# EAGLE design WiFiChristmasStar (EAGLE 9.2.2)
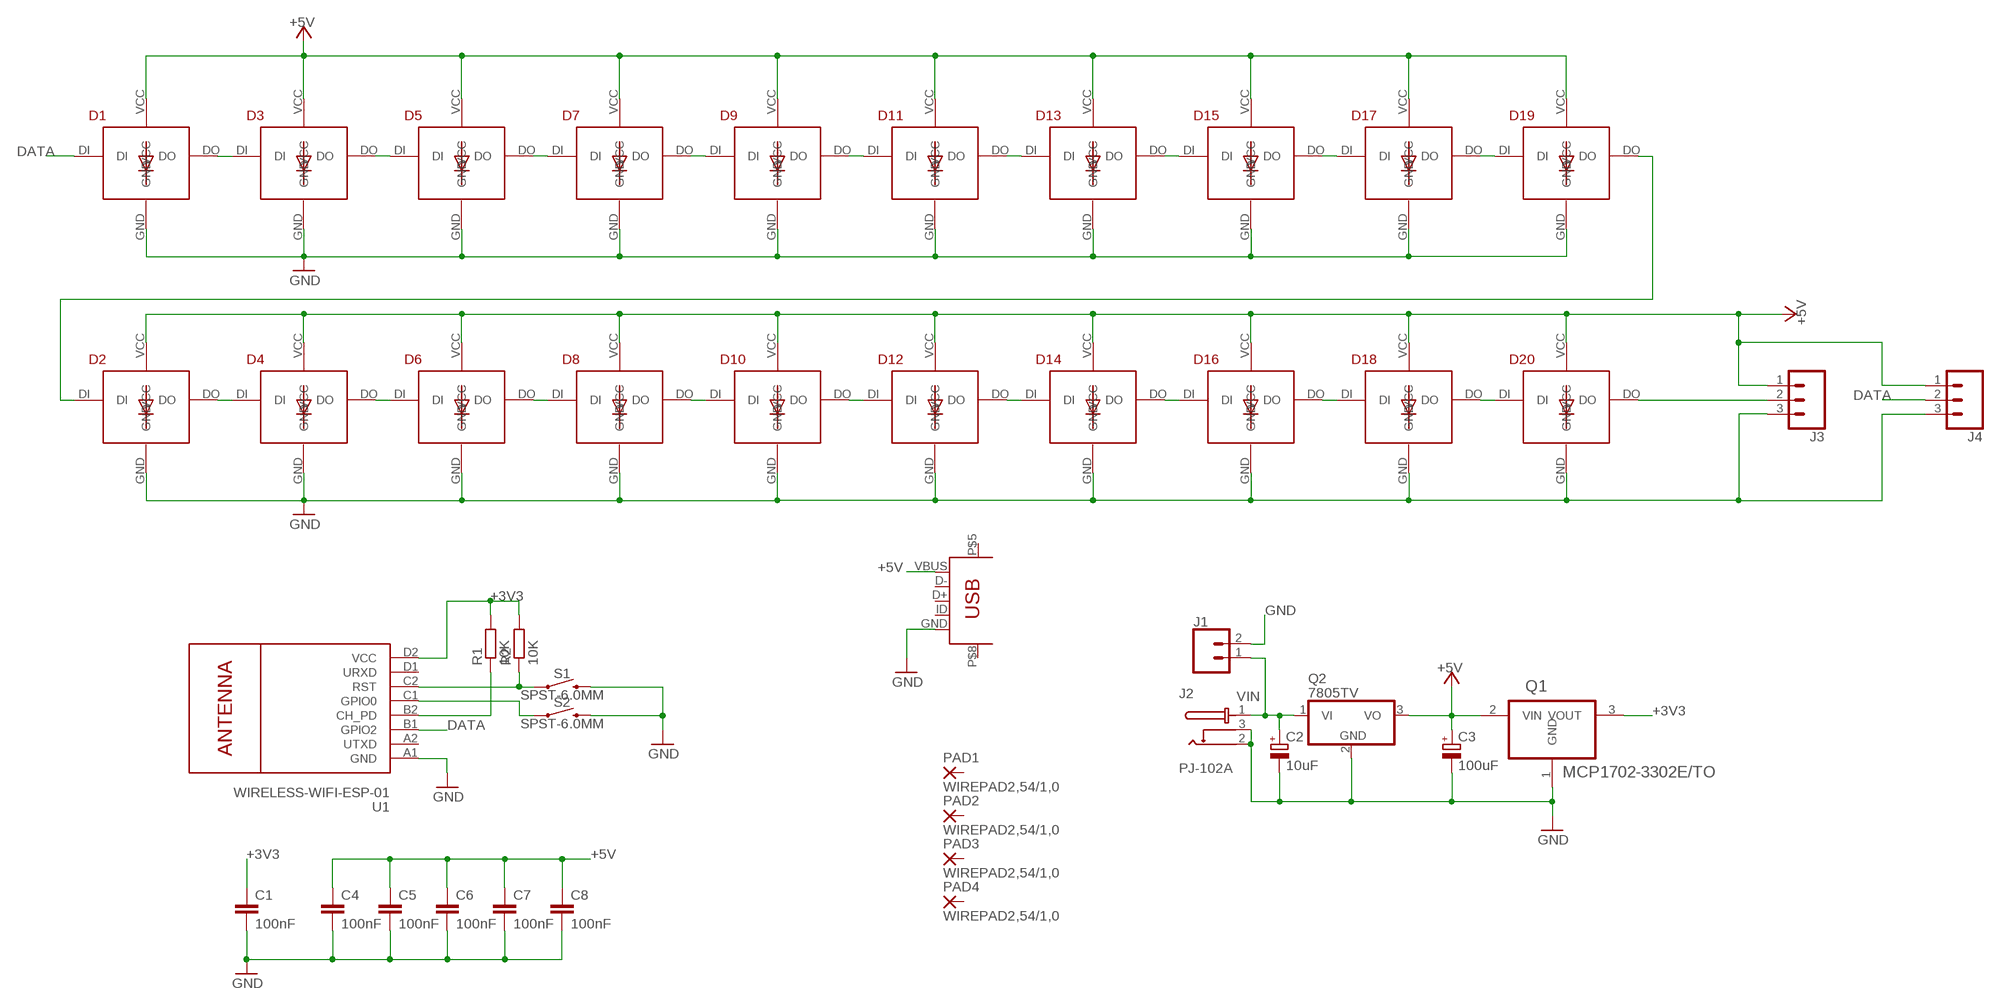
[diagram p0: schematic, sheet 1]

## Parts
C1  100nF  C-EU025-025X050  [C025-025X050]
C2  10uF  CPOL-EUE2.5-6  [E2,5-6]
C3  100uF  CPOL-EUE2.5-6  [E2,5-6]
C4  100nF  C-EU025-025X050  [C025-025X050]
C5  100nF  C-EU025-025X050  [C025-025X050]
C6  100nF  C-EU025-025X050  [C025-025X050]
C7  100nF  C-EU025-025X050  [C025-025X050]
C8  100nF  C-EU025-025X050  [C025-025X050]
CON1  MOLEX-548190519-MICROUSB  [MOLEX-548190519]
D1  APA-106  [LED5MMRGB]
D2  APA-106  [LED5MMRGB]
D3  APA-106  [LED5MMRGB]
D4  APA-106  [LED5MMRGB]
D5  APA-106  [LED5MMRGB]
D6  APA-106  [LED5MMRGB]
D7  APA-106  [LED5MMRGB]
D8  APA-106  [LED5MMRGB]
D9  APA-106  [LED5MMRGB]
D10  APA-106  [LED5MMRGB]
D11  APA-106  [LED5MMRGB]
D12  APA-106  [LED5MMRGB]
D13  APA-106  [LED5MMRGB]
D14  APA-106  [LED5MMRGB]
D15  APA-106  [LED5MMRGB]
D16  APA-106  [LED5MMRGB]
D17  APA-106  [LED5MMRGB]
D18  APA-106  [LED5MMRGB]
D19  APA-106  [LED5MMRGB]
D20  APA-106  [LED5MMRGB]
J1  CONN_023.5MM  [SCREWTERMINAL-3.5MM-2]
J2  PJ-102A  [CUI_PJ-102A]
J3  CONN_03SCREW  [SCREWTERMINAL-3.5MM-3]
J4  CONN_03SCREW  [SCREWTERMINAL-3.5MM-3]
PAD1  WIREPAD2,54/1,0  [2,54/1,0]
PAD2  WIREPAD2,54/1,0  [2,54/1,0]
PAD3  WIREPAD2,54/1,0  [2,54/1,0]
PAD4  WIREPAD2,54/1,0  [2,54/1,0]
Q1  MCP1702-3302E/TO  [TO127P254X533-3]
Q2  7805TV  [TO220V]
R1  10K  R-EU_0204/7  [0204/7]
R2  10K  R-EU_0204/7  [0204/7]
S1  SPST-6.0MM  MOMENTARY-SWITCH-SPST-PTH-6.0MM  [TACTILE_SWITCH_PTH_6.0MM]
S2  SPST-6.0MM  MOMENTARY-SWITCH-SPST-PTH-6.0MM  [TACTILE_SWITCH_PTH_6.0MM]
U1  WIRELESS-WIFI-ESP-01  [WIRELESS-WIFI-ESP-01]

## Nets
+3V3: C1.1 Q1.3(VOUT) R1.2 R2.2 U1.D2(VCC)
+5V [power]: C3.+ C4.1 C5.1 C6.1 C7.1 C8.1 CON1.VBUS D1.VCC D2.VCC D3.VCC D4.VCC D5.VCC D6.VCC D7.VCC D8.VCC D9.VCC D10.VCC D11.VCC D12.VCC D13.VCC D14.VCC D15.VCC D16.VCC D17.VCC D18.VCC D19.VCC D20.VCC J3.1 J4.1 Q1.2(VIN) Q2.3(VO)
DATA: D1.DI J4.2 U1.B1(GPIO2)
GND [power]: C1.2 C2.- C3.- C4.2 C5.2 C6.2 C7.2 C8.2 CON1.GND D1.GND D2.GND D3.GND D4.GND D5.GND D6.GND D7.GND D8.GND D9.GND D10.GND D11.GND D12.GND D13.GND D14.GND D15.GND D16.GND D17.GND D18.GND D19.GND D20.GND J1.2 J2.2 J2.3 J3.3 J4.3 Q1.1(GND) Q2.2(GND) S1.3 S2.3 U1.A1(GND)
N$1: S2.1 U1.C1(GPIO0)
N$2: D2.DO D4.DI
N$4: D4.DO D6.DI
N$5: R1.1 U1.B2(CH_PD)
N$6: R2.1 S1.1 U1.C2(RST)
N$7: D6.DO D8.DI
N$8: D8.DO D10.DI
N$9: D2.DI D19.DO
N$10: D10.DO D12.DI
N$11: D12.DO D14.DI
N$12: D14.DO D16.DI
N$13: D16.DO D18.DI
N$14: D18.DO D20.DI
N$15: D20.DO J3.2
N$16: D1.DO D3.DI
N$17: D17.DO D19.DI
N$18: D15.DO D17.DI
N$19: D13.DO D15.DI
N$20: D11.DO D13.DI
N$21: D9.DO D11.DI
N$22: D7.DO D9.DI
N$23: D5.DO D7.DI
N$24: D3.DO D5.DI
VIN [power]: C2.+ J1.1 J2.1 Q2.1(VI)
Unconnected: CON1.D+ CON1.D- CON1.ID CON1.P$5(MTN2) CON1.P$8(MTN4) PAD1.1(P) PAD2.1(P) PAD3.1(P) PAD4.1(P) U1.A2(UTXD) U1.D1(URXD)

## Library data of the parts
C1 C4-C8 = rcl:C-EU: CAPACITOR, European symbol; SPICEPREFIX: C
C2 C3 = rcl:CPOL-EU: POLARIZED CAPACITOR, European symbol; SPICEPREFIX: C
CON1 = Ava:MOLEX-548190519-MICROUSB
D1-D20 = led_rgb:APA-106
J1 = SparkFun-Connectors:CONN_02: Multi connection point. Often used as Generic Header-pin footprint for 0.1 inch spaced/style header connections On any of the 0.1 inch spaced packages, you can populate with these: Break Away Headers - Straight <https://www.sparkfun.com/products/116> (PRT-00116) Break Away Male Headers - Right Angle <https://www.sparkfun.com/products/553> (PRT-00553) Female Headers <https://www.sparkfun.com/products/115> (PRT-00115) Break Away Headers - Machine Pin <https://www.sparkfun.com/products/117> (PRT-00117) Break Away Female Headers - Swiss Machine Pin <https://www.sparkfun.com/products/743> (PRT-00743) For SCREWTERMINALS and SPRING TERMINALS visit here: Screw Terimnals on SparkFun.com <https://www.sparkfun.com/search/results?term=Screw+Terminals> (5mm/3.5mm/2.54mm spacing) This device is also useful as a general connection point to wire up your design to another part of your project. Our various solder wires solder well into these plated through hole pads. Hook-Up Wire - Assortment (Stranded, 22 AWG) <https://www.sparkfun.com/products/11375> (PRT-11375) Hook-Up Wire - Assortment (Solid Core, 22 AWG) <https://www.sparkfun.com/products/11367> (PRT-11367) View the entire wire category on our website here <https://www.sparkfun.com/categories/141> Special notes: Molex polarized connector foot print use with: PRT-08233 with associated crimp pins and housings. 2.54_SCREWTERM for use with PRT-10571. 3.5mm Screw Terminal footprints for PRT-08084 5mm Screw Terminal footprints for use with PRT-08432; PROD_ID: CONN-08399
J2 = PJ-102A:PJ-102A: 2.0 mm Center Pin, 2.5 A, Right Angle, Through Hole, Tapered Pins, Dc Power Jack Connector; AVAILABILITY: Good; DESCRIPTION: 2.0 mm Center Pin%2C 2.5 A%2C Right Angle%2C Through Hole%2C Tapered Pins%2C Dc Power Jack Connector; MANUFACTURER: CUI inc; MF: CUI; MP: PJ-102A; PACKAGE: None; PRICE: 0.44 USD
J3 J4 = SparkFun-Connectors:CONN_03: Multi connection point. Often used as Generic Header-pin footprint for 0.1 inch spaced/style header connections On any of the 0.1 inch spaced packages, you can populate with these: Break Away Headers - Straight <https://www.sparkfun.com/products/116> (PRT-00116) Break Away Male Headers - Right Angle <https://www.sparkfun.com/products/553> (PRT-00553) Female Headers <https://www.sparkfun.com/products/115> (PRT-00115) Break Away Headers - Machine Pin <https://www.sparkfun.com/products/117> (PRT-00117) Break Away Female Headers - Swiss Machine Pin <https://www.sparkfun.com/products/743> (PRT-00743) Stackable Header - 3 Pin (Female, 0.1") <https://www.sparkfun.com/products/13875> (PRT-13875) For SCREWTERMINALS and SPRING TERMINALS visit here: Screw Terimnals on SparkFun.com <https://www.sparkfun.com/search/results?term=Screw+Terminals> (5mm/3.5mm/2.54mm spacing) This device is also useful as a general connection point to wire up your design to another part of your project. Our various solder wires solder well into these plated through hole pads. Hook-Up Wire - Assortment (Stranded, 22 AWG) <https://www.sparkfun.com/products/11375> (PRT-11375) Hook-Up Wire - Assortment (Solid Core, 22 AWG) <https://www.sparkfun.com/products/11367> (PRT-11367) View the entire wire category on our website here <https://www.sparkfun.com/categories/141> Special notes: Molex polarized connector foot print use with SKU : PRT-08232 with associated crimp pins and housings.; PROD_ID: CONN-08288; SF_ID: PRT-08235
PAD1-PAD4 = wirepad:WIREPAD: Wire PAD connect wire on PCB
Q1 = MCP1702:MCP1702-3302E/TO: IC, V REG, LDO, 250MA; MPN: MCP1702-3302E/TO; OC_FARNELL: 1331485; OC_NEWARK: 34M7419; PACKAGE: TO-92; SUPPLIER: Microchip
Q2 = linear:78*: Positive VOLTAGE REGULATOR Source: http://cache.national.com/ds/LM/LM78L05.pdf http://www.fairchildsemi.com/ds/LM/LM7805.pdf
R1 R2 = rcl:R-EU_: RESISTOR, European symbol; SPICEPREFIX: R
S1 S2 = SparkFun-Switches:MOMENTARY-SWITCH-SPST: Momentary Switch (Pushbutton) - SPST Normally-open (NO) SPST momentary switches (buttons, pushbuttons). Variants PTH-12MM - 12mm square, through-hole Momentary Pushbutton Switch - 12mm Square <https://www.sparkfun.com/products/9190> (COM-09190) PTH-6.0MM, PTH-6.0MM-KIT - 6.0mm square, through-hole Mini Pushbutton Switch <https://www.sparkfun.com/products/97> (COM-00097) KIT package intended for soldering kit's - only one side of pads' copper is exposed. PTH-RIGHT-ANGLE-KIT - Right-angle, through-hole Right Angle Tactile Button <https://www.sparkfun.com/products/10791> - Used on SparkFun BigTime Watch Kit <https://www.sparkfun.com/products/11734> SMD-12MM - 12mm square, surface-mount Tactile Button - SMD (12mm) <https://www.sparkfun.com/products/12993> (COM-12993) Used on SparkFun PicoBoard <https://www.sparkfun.com/products/11888> SMD-4.5MM - 4.5mm Square Trackball Switch Used on SparkFun Blackberry Trackballer Breakout <https://www.sparkfun.com/products/13169> SMD-4.6MMX2.8MM - 4.60mm x 2.80mm, surface mount Used on SparkFun SAMD21 Mini Breakout <https://www.sparkfun.com/products/13664> SMD-5.2MM, SMD-5.2-REDUNDANT - 5.2mm square, surface-mount Mini Pushbutton Switch - SMD <https://www.sparkfun.com/products/8720> (COM-08720) Used on Arduino Pro Mini <https://www.sparkfun.com/products/11114> REDUNDANT package connects both switch circuits together SMD-6.0X3.5MM - 6.0 x 3.5mm, surface mount Momentary Reset Switch SMD <https://www.sparkfun.com/products/8229> (COM-08229) SMD-6.2MM-TALL - 6.2mm square, surface mount Tactile Button - SMD (6mm) <https://www.sparkfun.com/products/12992> Used on SparkFun Digital Sandbox <https://www.sparkfun.com/products/12651> SMD-RIGHT-ANGLE - Right-angle, surface mount Used on SparkFun Block for Intel® Edison - Arduino <https://www.sparkfun.com/products/13036>; PROD_ID: SWCH-08441; SF_SKU: COM-00097
U1 = diy-modules:WIRELESS-WIFI-ESP-01: Wireless Wi-Fi ESP-01 Module based on ESP8266 chip Click here to find device on ebay.com <http://www.ebay.com/sch/esp8266+esp+01+transceiver>

## Net classes
0 default: width 0.152 mm, drill 0.152 mm, clearance 0.152 mm
1 power: width 0.254 mm, drill 0.152 mm, clearance 0.152 mm

## Board
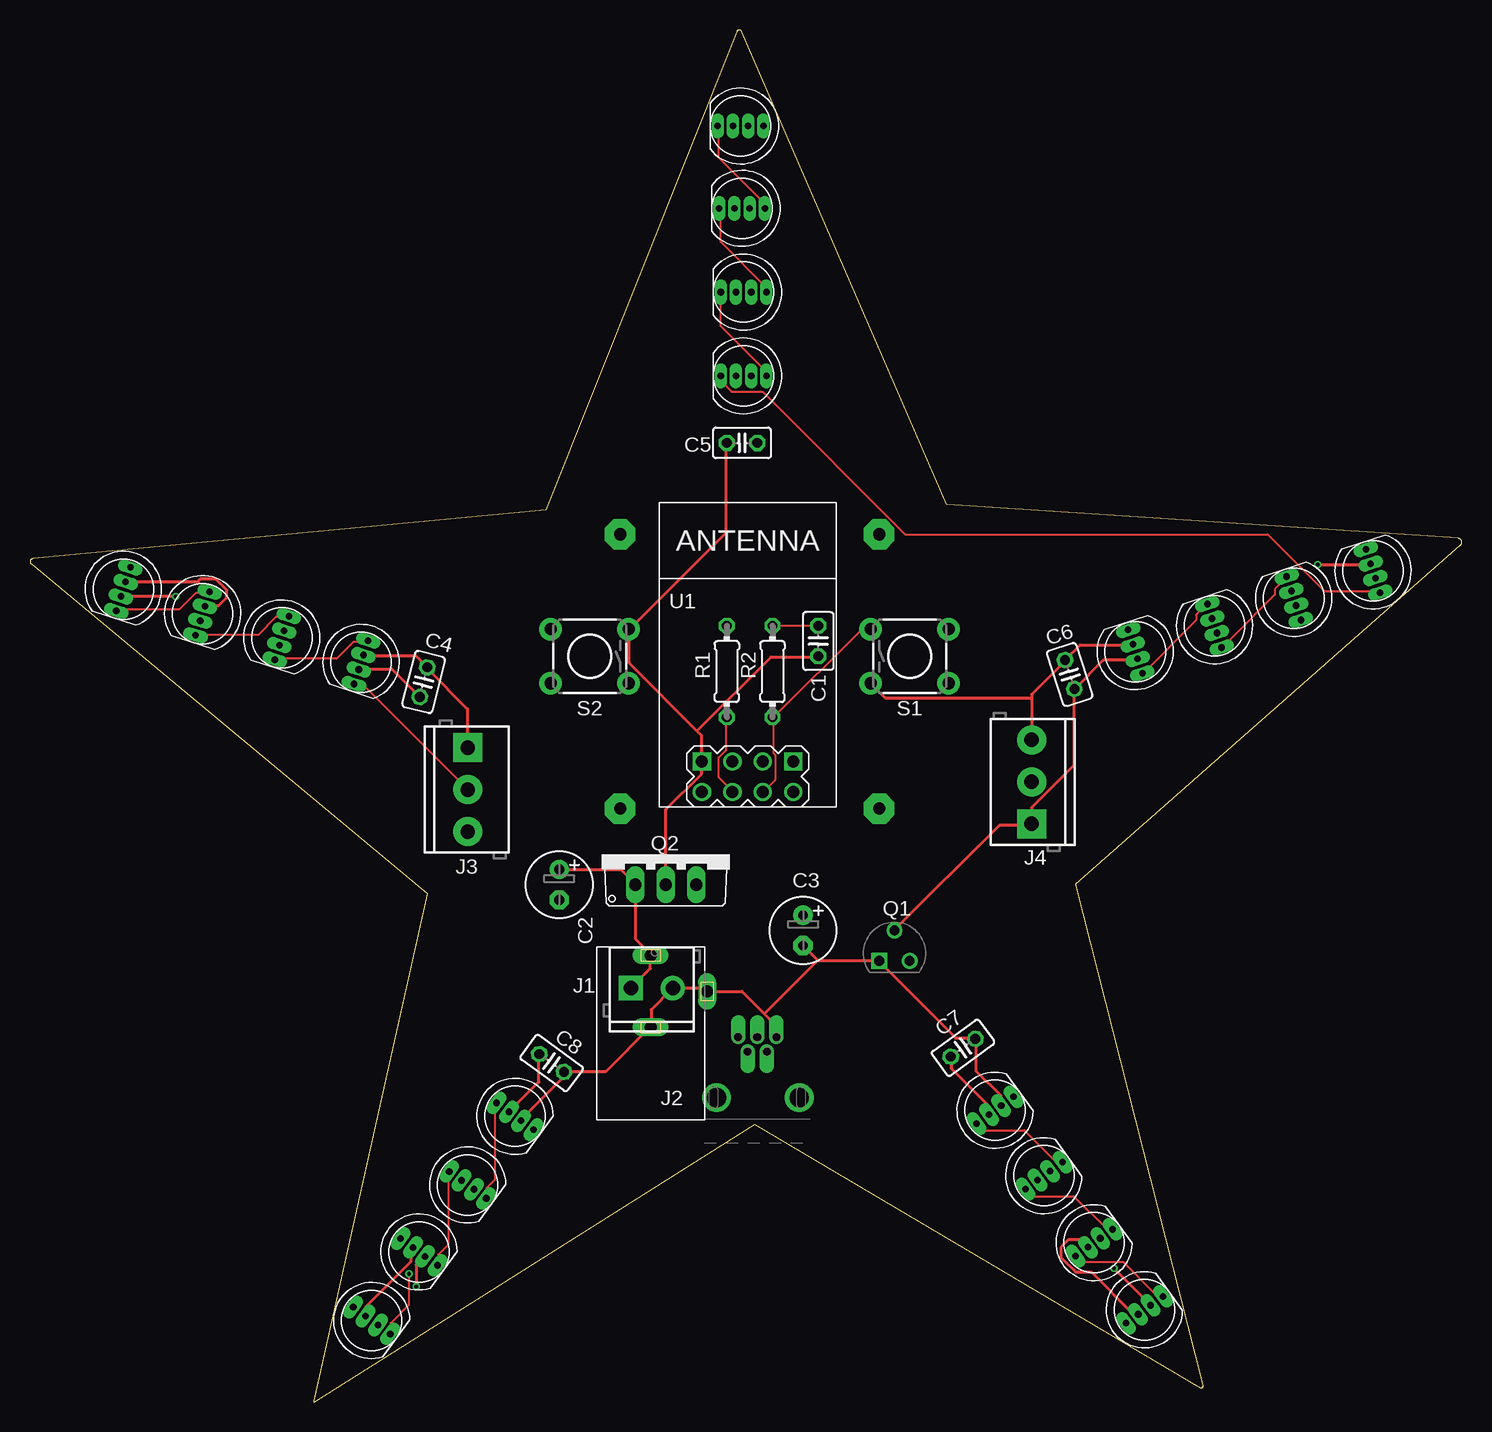
[diagram p1: board, top side]
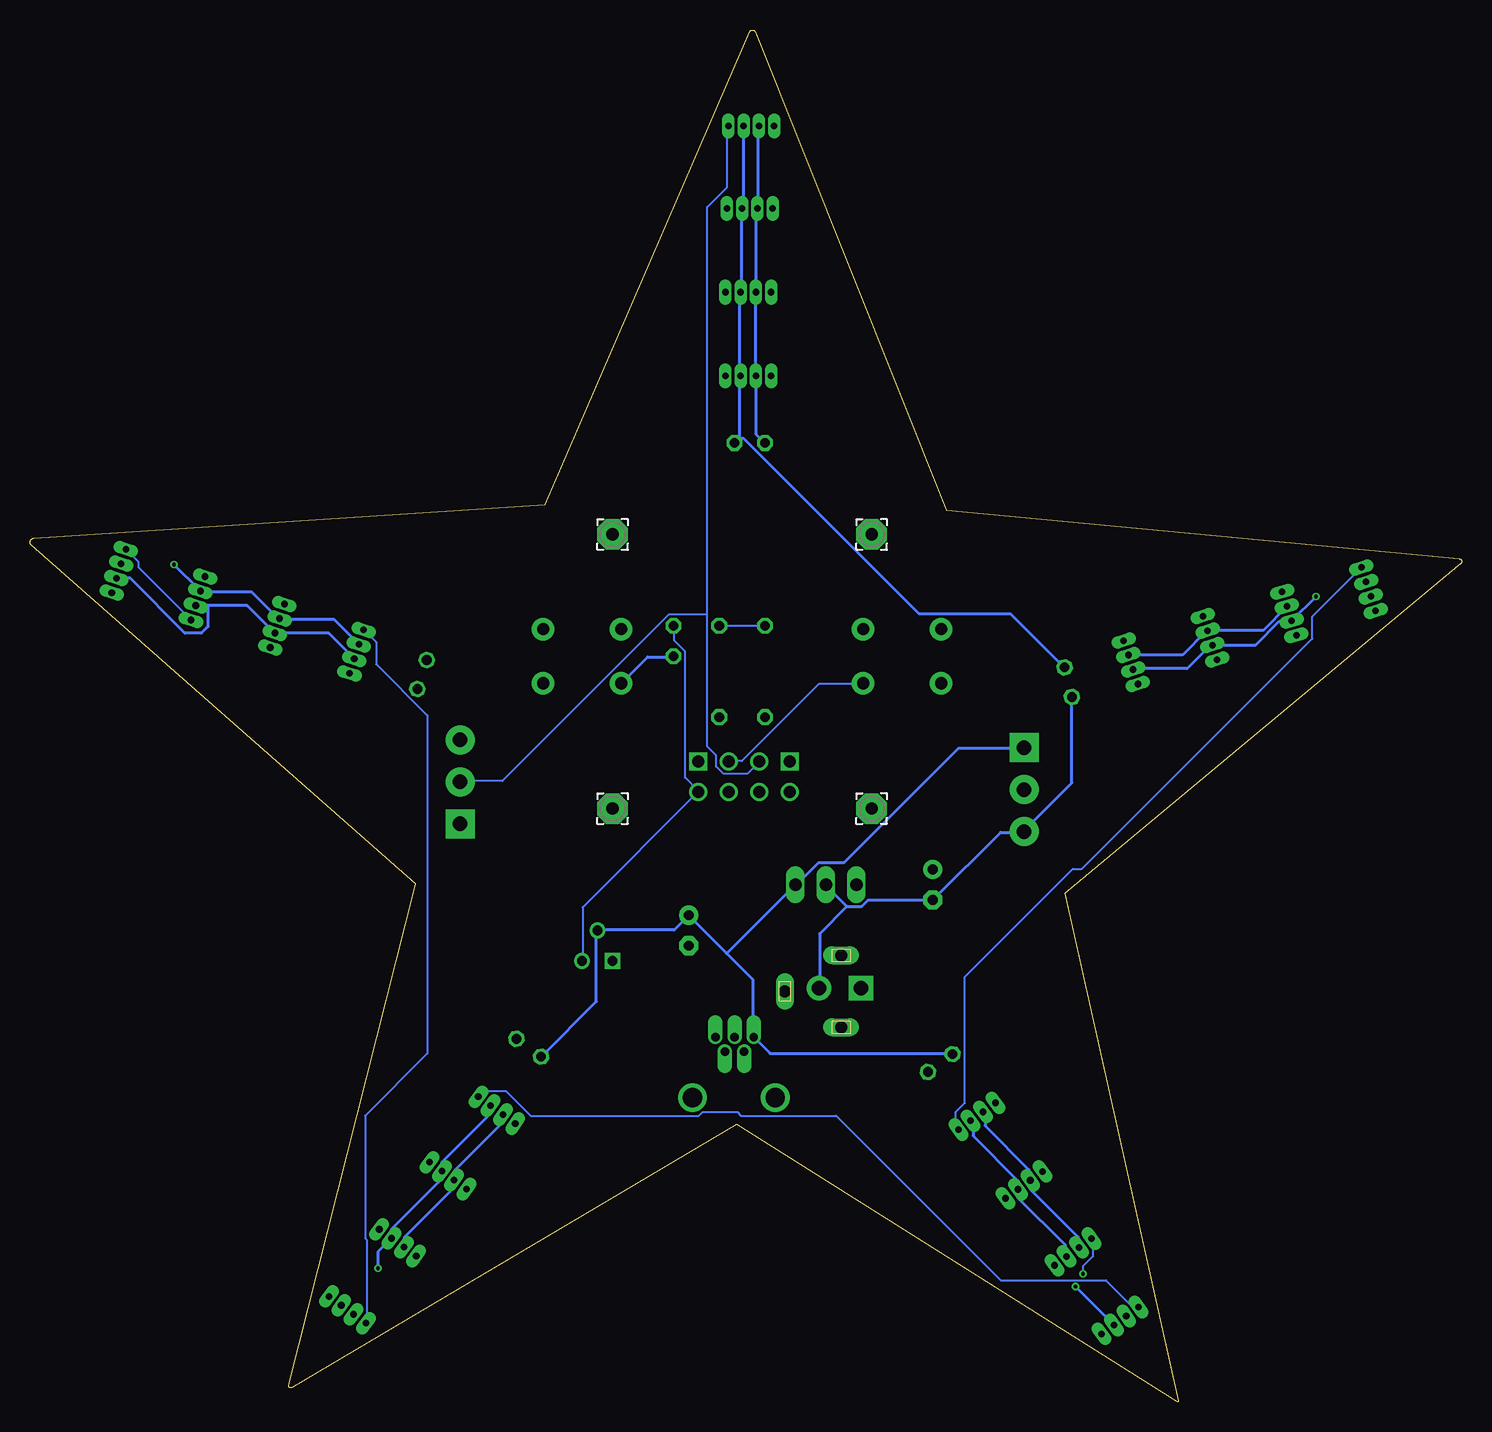
[diagram p2: board, bottom side, seen from below]

Size 119.32 x 114.36 mm. Coordinates in mm from the lower left corner, seen from the top.
Outline: 76.39,74.8 59.33,114.22 arc135 58.9,114.22 42.97,74.32 0.21,70.28 arc135 0.09,69.87 33.1,42.39 23.64,0.07 arc135 23.73,0.01 60.41,23.14 97.51,1.2 arc135 97.76,1.38 87.17,43.17 119.21,71.41 arc135 119.01,71.99 76.39,74.8
Copper layers (1*16): Top 0.035mm / dielectric 1.5mm / Bottom 0.035mm
Design rules "PCBWay": minimum track width 6mil, minimum drill 12mil, track to track 6mil, track to pad 6mil, pad to pad 6mil, via to via 6mil, smd to smd 0mil, copper to edge 10mil, drill to drill 10mil, minimum pad ring 10mil, minimum via ring 6mil, stop-mask expansion 2mil, vias tented up to drill 25mil, thermal gap 10mil
tRestrict: area -1.6,39.3 to 35.3,70.5; area 21.8,-1.3 to 62.1,24.1; area 86.3,-0.4 to 101.3,45.2; area 75.3,71.3 to 120.3,77.5; area 59.3,-1.8 to 98.4,22.8; area 18.9,-1.1 to 33.7,42.9; area 87.8,41.8 to 120.3,71; area 87.4,42.2 to 119.9,71.4
bRestrict: area -1.8,39 to 35.5,70.5; area 23.3,-0.4 to 62.1,24.1; area 86.4,0.4 to 101.6,45.1; area 75.6,71.3 to 120,76.7; area 60.5,-0.1 to 97.3,22.7; area 19.3,-1.2 to 33.8,43.5; area 87.3,42.2 to 119.8,71.4
Milling: 15 lines

### Footprints (pad centres in the part's own frame; a part is rotated, then mirrored left to right if it is on the bottom)
C025-025X050 = drill 0.813 octagon: 1 -1.27,0; 2 1.27,0
E2,5-6 = drill 0.813 pad 1.6: + -1.27,0 | drill 0.813 pad 1.6 octagon: - 1.27,0
MOLEX-548190519 = drill 0.7 pad 0.9 offset: D+ 0,0; D- -1.2,0.8; GND 0,-1.6; ID -1.2,-0.8; VBUS 0,1.6 | drill 1.6: P$5 -5.05,3.4; P$8 -5.05,-3.5
LED5MMRGB = drill 0.55 pad 1.016 long: DI 1.905,0; DO -1.905,0; GND -0.635,0; VCC 0.635,0
SCREWTERMINAL-3.5MM-2 = drill 1.2 pad 2.032 square: 1 0,0 | drill 1.2 pad 2.032: 2 3.5,0
CUI_PJ-102A = drill 1 long: 1 0,-3; 2 0,3; 3 -4.7,0
SCREWTERMINAL-3.5MM-3 = drill 1.2 pad 2.413 square: 1 0,0 | drill 1.2 pad 2.413: 2 3.5,0; 3 7,0
2,54/1,0 = drill 1.016 pad 2.54 octagon: 1 0,0
TO127P254X533-3 = drill 0.8 square: 1 -2.54,-2.54 | drill 0.8: 2 -1.27,0; 3 0,-2.54
TO220V = drill 1.016 long: 1 -2.54,-2.54; 2 0,-2.54; 3 2.54,-2.54
0204/7 = drill 0.813 octagon: 1 -3.81,0; 2 3.81,0
TACTILE_SWITCH_PTH_6.0MM = drill 1.016 pad 1.88: 1 -3.251,2.261; 2 3.251,2.261; 3 -3.251,-2.261; 4 3.251,-2.261
WIRELESS-WIFI-ESP-01 = drill 1 square: A1 -8.89,3.81; D1 -8.89,-3.81 | drill 1: A2 -11.43,3.81; B1 -8.89,1.27; B2 -11.43,1.27; C1 -8.89,-1.27; C2 -11.43,-1.27; D2 -11.43,-3.81

### Placement (x,y rotation side)
C1  65.69,63.43 270 top
C2  44.1,43.11 270 top
C3  64.42,39.3 270 top
C4  32.8,60 256 top
C5  59.34,79.94 180 top
C6  86.64,60.64 108 top
C7  77.75,29.52 36 top
C8  43.46,28.25 324 top
CON1  60.61,30.41 90 top
D1  59.21,106.36 0 top
D2  84.48,18.85 216 top
D3  59.34,99.5 0 top
D4  80.42,24.31 216 top
D5  59.47,92.51 0 top
D6  28.48,6.79 144 top
D7  59.47,85.53 0 top
D8  32.41,12.5 144 top
D9  111.92,69.27 288 top
D10  36.48,18.09 144 top
D11  105.31,66.99 288 top
D12  40.42,23.81 144 top
D13  98.71,64.7 288 top
D14  7.78,67.75 72 top
D15  92.1,62.54 288 top
D16  14.38,65.72 72 top
D17  92.87,7.68 216 top
D18  20.98,63.68 72 top
D19  88.68,13.26 216 top
D20  27.59,61.65 72 top
J1  50.07,34.47 0 top
J2  51.72,34.22 180 top
J3  36.48,54.54 270 top
J4  83.47,48.19 90 top
PAD1  49.18,72.32 0 bottom
PAD2  49.18,49.46 0 bottom
PAD3  70.77,72.32 0 bottom
PAD4  70.77,49.46 0 bottom
Q1  73.31,39.3 0 top
Q2  52.99,45.65 0 top
R1  58.07,60.89 90 top
R2  61.88,60.89 90 top
S1  73.31,62.16 0 top
S2  46.64,62.16 180 top
U1  59.81,62.29 90 top

### Tracks (layer width: path | path; a pad name or v marks a point on that pad's centre or on a via)
+3V3
  Top 0.152: R2.2 C1.1
  Bottom 0.152: R2.2 R1.2 | Q1.3 73.26,36.81 73.26,41.23 63.66,50.83 U1.D2 63.66,50.98 64.72,52.05 64.72,62.57 65.64,63.48 65.64,64.7 C1.1
+5V
  Top 0.254: D20.VCC 27.84,62.18 32.19,62.18 33.1,61.27 C4.1 33.1,61.12 36.45,57.77 36.45,54.56 J3.1 | D14.VCC 8.03,68.36 13.97,68.36 14.2,68.59 15.5,68.59 16.41,67.67 16.41,67.06 15.73,66.38 14.58,66.38 D16.VCC | D15.VCC 92.23,61.88 89.49,61.88 87.05,59.44 C6.1 86.97,59.37 86.97,53.04 83.47,49.54 J4.1 83.39,48.09 80.8,48.09 72.04,39.32 Q1.2 | 39.88,24.16 D12.VCC 39.96,24.24 42.4,26.68 42.4,28.96 C8.1 | D4.VCC 79.89,24.01 79.89,24.69 76.76,27.82 76.76,28.73 C7.1 | D17.VCC 92.31,7.32 91.93,7.32 88.42,10.83 87.13,10.83 85.91,12.05 85.91,12.88 86.52,13.49 87.58,13.49 88.12,12.96 D19.VCC | D6.VCC 27.99,7.17 27.99,7.93 31.73,11.66 31.73,12.65 31.88,12.81 D8.VCC
  Bottom 0.254: D1.VCC 59.85,99.68 59.92,99.6 D3.VCC 60,99.45 60,92.59 D5.VCC 60.15,92.51 60.15,85.58 D7.VCC 60.15,85.5 60.15,80.4 C5.1 60.08,80.32 59.85,80.32 45.22,65.69 37.6,65.69 33.18,61.27 C4.1 | D16.VCC 14.58,66.3 16.56,64.32 21.14,64.32 D18.VCC 21.29,64.24 23.27,62.26 27.77,62.26 D20.VCC | D15.VCC 92.31,61.96 94.44,64.09 98.86,64.09 D13.VCC 99.01,64.17 101.22,66.38 105.49,66.38 D11.VCC 104.5,66.3 104.5,64.62 105.03,64.09 106.4,64.09 110.98,68.66 112.04,68.66 D9.VCC | 61.26,37.38 64.42,40.54 C3.+ 64.49,40.47 65.64,39.32 72.04,39.32 Q1.2 72.11,39.25 72.11,33.38 76.69,28.81 C7.1 | 61.26,37.38 59.08,35.21 59.08,30.41 CON1.VBUS 58.93,30.33 57.64,29.04 42.47,29.04 C8.1 | 61.26,37.38 Q2.3 55.43,43.13 53.6,44.96 51.46,44.96 41.94,54.49 36.53,54.49 J3.1 | D4.VCC 79.96,23.93 79.96,23.25 83.93,19.28 83.93,18.52 D2.VCC 84,18.37 84,17.84 88.12,13.72 88.12,12.96 D19.VCC | D8.VCC 31.96,12.88 31.96,13.72 35.92,17.68 35.92,18.45 D10.VCC 36.07,18.52 36.07,19.36 39.73,23.02 39.73,24.01 39.88,24.16 D12.VCC
DATA
  Bottom 0.152: 62.89,65.61 62.89,54.64 62.13,53.88 62.13,52.96 61.52,52.36 59.54,52.36 58.63,53.27 U1.B1 | 62.89,65.61 62.89,99.6 61.22,101.28 61.22,106.3 D1.DI | 62.89,65.61 66.09,65.61 79.96,51.75 83.47,51.75 J4.2
GND  (via drill 0.3)
  Top 0.254: D15.GND 91.85,63.1 87.51,63.1 86.29,61.88 C6.2 86.21,61.73 83.47,58.98 83.47,58.68 | v107.32,69.8 111.66,69.8 D9.GND | 83.47,58.68 J4.3 | D4.GND 80.88,24.69 80.88,25.53 78.82,27.59 78.82,30.26 C7.2 78.67,30.33 77.14,30.33 70.82,36.66 Q1.1 70.74,36.81 65.64,36.81 | v90.33,11.13 93.37,8.08 D17.GND | 40.72,23.25 40.87,23.4 D12.GND 40.95,23.55 44.45,27.06 44.45,27.44 C8.2 44.61,27.51 47.96,27.51 51.62,31.17 J2.2 51.77,31.25 51.77,32.7 53.52,34.45 J1.2 53.67,34.45 56.19,34.45 56.34,34.3 J2.3 59.31,34.22 61.18,32.35 | D20.GND 27.46,61.04 30.2,61.04 32.41,58.83 C4.2 | v12.15,67.14 7.65,67.14 D14.GND | C3.- 65.64,36.81 | 61.18,32.35 62.13,31.4 62.13,30.41 CON1.GND | 61.18,32.35 65.64,36.81 | Q2.2 52.99,49.38 55.96,52.36 55.96,53.35 U1.A1 55.96,53.5 55.96,55.56 55.58,55.94 | 55.58,55.94 49.94,61.58 49.94,64.39 S2.3 50.02,64.47 58.02,72.47 58.02,79.94 C5.2 | 55.58,55.94 61.75,62.11 65.64,62.11 C1.2 | 83.47,58.68 71.28,58.68 S1.3 | v32.19,9.61 32.19,11.44 32.87,12.12 D8.GND
  Bottom 0.254: D15.GND 91.93,63.18 93.98,65.23 98.48,65.23 D13.GND 98.63,65.31 100.84,67.52 105.11,67.52 D11.GND 105.19,67.67 v107.32,69.8 | D4.GND 80.95,24.62 80.95,24.01 84.99,19.97 84.99,19.28 D2.GND 85.07,19.13 85.07,18.52 89.18,14.41 D19.GND 89.26,13.57 90.33,12.5 v90.33,11.13 | 29.06,6.48 D6.GND 29.14,6.56 v32.19,9.61 | v12.15,67.14 14.13,65.16 D16.GND 14.2,65.08 15.19,65.08 17.17,63.1 20.76,63.1 D18.GND 20.91,63.1 22.89,61.12 27.39,61.12 D20.GND | D1.GND 58.63,106.3 58.63,99.6 58.7,99.52 D3.GND 58.78,99.45 58.78,92.59 D5.GND 58.86,92.51 58.86,85.58 D7.GND 58.78,85.5 58.78,80.63 58.09,79.94 C5.2 | S1.3 67.85,62.11 65.71,62.11 C1.2 | 51.24,41.31 50.02,41.31 49.48,41.84 C2.- 44,41.92 38.43,47.48 36.53,47.48 J3.3 36.45,47.63 32.49,51.59 32.49,58.76 C4.2 | 51.24,41.31 52.99,43.06 Q2.2 | 51.24,41.31 53.52,39.02 53.52,34.52 J1.2 | D8.GND 32.95,12.2 33.02,12.27 33.02,13.04 36.99,17 36.99,17.68 D10.GND 36.99,17.84 36.99,18.45 40.72,22.18 40.72,23.25 40.87,23.4 D12.GND
N$1
  Bottom 0.152: U1.C1 61.07,53.42 60,53.42 53.6,59.82 49.94,59.82 S2.1
N$2
  Top 0.152: D2.DO 85.91,20.05 85.45,20.05 82.86,22.64 79.35,22.64 78.9,23.09 D4.DI
N$4
  Bottom 0.152: D6.DI 27,7.93 27.46,7.93 29.67,10.14 38.43,10.14 52.15,23.86 60.08,23.86 60.38,24.16 63.28,24.16 63.58,23.86 77.6,23.86 79.66,25.91 81.49,25.91 81.94,25.46 D4.DO
N$5
  Top 0.152: R1.1 58.02,57.08 58.02,54.34 57.41,53.73 57.41,52.05 58.47,50.98 U1.B2
N$6
  Top 0.152: 61.98,57.08 61.98,54.03 62.13,53.88 62.13,51.9 61.22,50.98 U1.C2 | 61.98,57.08 69.3,64.39 70.06,64.39 S1.1 | 61.98,57.08 R2.1
N$7  (via drill 0.3)
  Top 0.152: v31.58,10.67 31.58,8.08 30.05,6.56 30.05,5.72 D6.DO
  Bottom 0.152: v31.58,10.67 31.58,11.28 30.74,12.12 30.74,13.49 30.81,13.57 D8.DI
N$8
  Top 0.152: D8.DO 34.01,11.44 34.01,12.27 34.85,13.11 34.85,19.13 D10.DI
N$9
  Top 0.152: D19.DO 90.17,14.41 89.72,14.41 86.97,17.15 83.47,17.15 83.01,17.61 D2.DI
N$10
  Top 0.152: D10.DO 38.05,17 38.05,17.84 38.74,18.52 38.74,24.85 38.82,24.92 D12.DI
  Bottom 0.152: 38.82,24.92 D12.DI
N$11
  Bottom 0.152: D14.DI 8.49,69.42 12.45,65.46 12.45,63.63 31.65,44.43 32.41,44.43 41.41,35.44 41.41,24.92 42.17,24.16 42.17,22.94 42.02,22.79 D12.DO
N$12
  Top 0.152: D14.DO 7.27,66.07 12.45,66.07 13.82,67.44 14.89,67.44 D16.DI
N$13
  Top 0.152: D16.DO 13.82,63.94 19,63.94 20.53,65.46 21.44,65.46 D18.DI
N$14
  Top 0.152: D18.DO 20.53,61.96 25.56,61.96 26.93,63.33 28.15,63.33 D20.DI
N$15
  Top 0.152: D20.DO 27.08,59.82 27.69,59.82 36.38,51.14 J3.2
N$16
  Top 0.152: D1.DO 57.41,106.3 57.41,103.71 61.22,99.9 61.22,99.6 D3.DI
N$17
  Top 0.152: D17.DO 94.29,8.92 93.83,8.92 91.09,11.66 87.74,11.66 87.28,12.12 D19.DI
N$18
  Bottom 0.152: D17.DI 91.24,6.64 91.24,13.49 91.39,13.65 91.39,23.86 86.21,29.04 86.21,57.23 90.48,61.5 90.48,63.33 91.39,64.24 D15.DO
N$19
  Top 0.152: D15.DI 92.76,60.74 97.18,65.16 97.18,65.61 98.1,66.53 D13.DO
N$20
  Top 0.152: D13.DI 99.32,63.02 99.78,63.48 99.93,63.48 103.74,67.29 103.74,67.75 104.65,68.66 D11.DO
N$21
  Bottom 0.152: D11.DI 106.02,65.31 110.29,69.58 110.29,70.03 111.21,70.95 D9.DO
N$22
  Top 0.152: D7.DO 57.56,85.12 58.47,84.21 61.07,84.21 72.95,72.32 103.13,72.32 107.85,67.6 112.42,67.6 D9.DI
N$23
  Top 0.152: D5.DO 57.56,89.69 61.37,85.88 D7.DI
N$24
  Top 0.152: D5.DI 61.37,92.89 57.56,96.7 57.56,99.45 D3.DO
VIN
  Top 0.254: J1.1 50.09,34.52 51.69,36.12 51.69,37.19 J2.1 51.69,37.34 50.47,38.56 50.47,43.06 Q2.1 50.4,43.21 49.25,44.35 44.15,44.35 C2.+

### Text on the board
tDocu: 1 | 4 | 5 | Hack All The Stars! | WiFi Star V1.1 | 17 | Prog | Reset | 8 | 20 | GND-DO-5V | 5V-DI-GND | + - | 12 | 5V Only | 16 | 7-12V | 13 | 9
bDocu: WiFi Star V1.1 | Hack All The Stars!